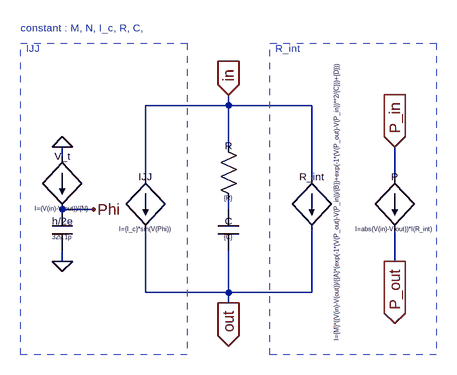
[diagram p0: schematic 1stack_RC.asc]
1stack_RC.asc, the LTspice schematic file:
Version 4
SHEET 1 880 680
WIRE 224 16 224 0
WIRE 224 16 96 16
WIRE 352 16 224 16
WIRE 224 80 224 16
WIRE -32 96 -32 80
WIRE 96 128 96 16
WIRE 352 128 352 16
WIRE 480 128 480 80
WIRE 16 176 -32 176
WIRE 224 176 224 160
WIRE -32 256 -32 240
WIRE 480 256 480 208
WIRE 96 304 96 208
WIRE 224 304 224 240
WIRE 224 304 96 304
WIRE 352 304 352 208
WIRE 352 304 224 304
WIRE 224 320 224 304
FLAG 224 0 in
IOPIN 224 0 In
FLAG 224 320 out
IOPIN 224 320 Out
FLAG 480 80 P_in
IOPIN 480 80 In
FLAG 480 256 P_out
IOPIN 480 256 Out
FLAG -32 80 0
FLAG -32 256 0
FLAG 16 176 Phi
SYMBOL bi 96 128 R0
WINDOW 0 0 8 Bottom 1
WINDOW 3 0 72 Top 0
SYMATTR InstName IJJ
SYMATTR Value I={I_c}*sin(V(Phi))
SYMBOL bi 352 128 R0
WINDOW 0 0 8 Bottom 1
WINDOW 3 32 32 VTop 0
SYMATTR InstName R_int
SYMATTR Value I={M}*((V(in)-V(out))/({A}*(exp(-1*(V(P_out)-V(P_in))/{B})+exp(-1*(V(P_out)-V(P_in))**2/{C}))+{D}))
SYMBOL res 208 64 R0
WINDOW 0 16 24 Bottom 1
WINDOW 3 16 88 Top 0
SYMATTR InstName R
SYMATTR Value {R}
SYMBOL cap 208 176 R0
WINDOW 0 16 28 Bottom 1
WINDOW 3 16 36 Top 0
SYMATTR InstName C
SYMATTR Value {C}
SYMBOL bi 480 128 R0
WINDOW 0 0 8 Bottom 1
WINDOW 3 0 72 Top 0
SYMATTR InstName P
SYMATTR Value I=abs(V(in)-V(out))*I(R_int)
SYMBOL bi -32 96 R0
WINDOW 0 0 8 Bottom 1
WINDOW 3 0 72 Top 0
SYMATTR InstName V_t
SYMATTR Value I=(V(in)-V(out))/{N}
SYMBOL cap -48 176 R0
WINDOW 0 16 28 Bottom 1
WINDOW 3 16 36 Top 0
SYMATTR InstName h/2e
SYMATTR Value 329.1p
TEXT -96 -104 Left 1 ;constant : M, N, I_c, R, C,
TEXT -88 -72 Left 1 ;IJJ
TEXT 296 -72 Left 1 ;R_int
RECTANGLE Normal -96 -80 160 400 2
RECTANGLE Normal 544 400 288 -80 2

The netlist it stands for:
* 1stack_RC.asc
B§IJJ in out I={I_c}*sin(V(Phi))
B§R_int in out I={M}*((V(in)-V(out))/({A}*(exp(-1*(V(P_out)-V(P_in))/{B})+exp(-1*(V(P_out)-V(P_in))**2/{C}))+{D}))
R in N001 {R}
C N001 out {C}
B§P P_in P_out I=abs(V(in)-V(out))*I(R_int)
B§V_t 0 Phi I=(V(in)-V(out))/{N}
C§h/2e Phi 0 329.1p
* constant : M, N, I_c, R, C,
* IJJ
* R_int
.backanno
.end